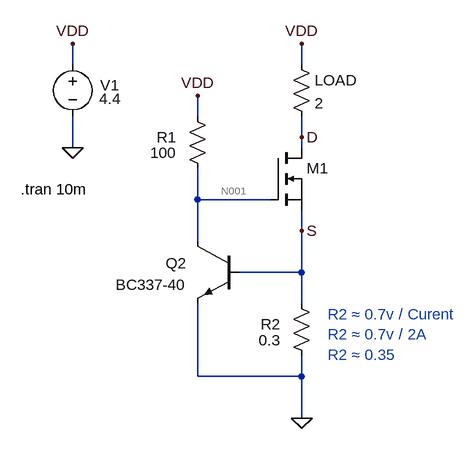
[diagram p0: schematic v1.0.asc]
v1.0.asc, the LTspice schematic file:
Version 4.1
SHEET 1 884 948
WIRE 128 256 128 224
WIRE 480 256 480 224
WIRE 320 336 320 304
WIRE 480 368 480 336
WIRE 128 384 128 336
WIRE 480 384 480 368
WIRE 320 464 320 416
WIRE 432 464 320 464
WIRE 480 512 480 480
WIRE 320 528 320 464
WIRE 480 576 480 512
WIRE 480 576 384 576
WIRE 480 624 480 576
WIRE 320 736 320 624
WIRE 480 736 480 704
WIRE 480 736 320 736
WIRE 480 800 480 736
FLAG 128 384 0
FLAG 480 800 0
FLAG 128 224 VDD
FLAG 480 224 VDD
FLAG 320 304 VDD
FLAG 480 512 S
FLAG 480 368 D
SYMBOL voltage 128 240 R0
WINDOW 0 42 48 Left 2
WINDOW 3 41 69 Left 2
WINDOW 123 0 0 Left 0
WINDOW 39 0 0 Left 0
SYMATTR InstName V1
SYMATTR Value 4.4
SYMBOL res 336 432 R180
WINDOW 0 48 64 Left 2
WINDOW 3 48 40 Left 2
SYMATTR InstName R1
SYMATTR Value 100
SYMBOL npn 384 528 M0
WINDOW 0 81 34 Left 2
WINDOW 3 190 67 Right 2
SYMATTR InstName Q2
SYMATTR Value BC337-40
SYMBOL res 496 720 R180
WINDOW 0 48 64 Left 2
WINDOW 3 48 40 Left 2
SYMATTR InstName R2
SYMATTR Value 0.3
SYMBOL res 464 240 R0
SYMATTR InstName LOAD
SYMATTR Value 2
SYMBOL nmos 432 384 R0
WINDOW 3 56 72 Invisible 2
SYMATTR Value PSMN1R025YLD
SYMATTR InstName M1
TEXT 48 448 Left 2 !.tran 10m
TEXT 520 640 Left 2 ;R2 ≈ 0.7v / Curent\nR2 ≈ 0.7v / 2A\nR2 ≈ 0.35

The netlist it stands for:
* v1.0.asc
V1 VDD 0 4.4
R1 N001 VDD 100
Q2 N001 S 0 0 BC337-40
R2 0 S 0.3
R§LOAD VDD D 2
M1 D N001 S S PSMN1R025YLD
.model NPN NPN
.model PNP PNP
.lib standard.bjt
.model NMOS NMOS
.model PMOS PMOS
.lib standard.mos
.tran 10m
* R2 ≈ 0.7v / Curent
* R2 ≈ 0.7v / 2A
* R2 ≈ 0.35
.backanno
.end

* Results of the author's LTspice run, read from the files saved beside the schematic
* Operating Point, zero values left out:
*   V(d) = 575.9 mV
*   V(n001) = 4.36 V
*   V(s) = 573.6 mV
*   V(vdd) = 4.4 V
*   I(LOAD) = 1.912 A
*   I(R1) = -399.6 µA
*   I(R2) = -1.912 A
*   I(V1) = -1.912 A
*   Ib(Q2) = 934.9 nA
*   Ic(Q2) = 399.6 µA
*   Id(M1) = 1.912 A
*   Ie(Q2) = -400.5 µA
*   Is(M1) = -1.912 A
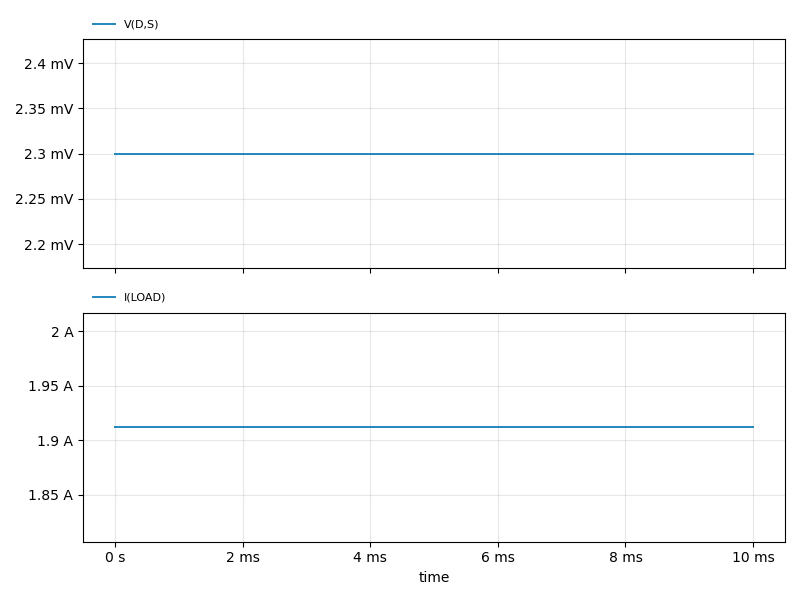
[diagram p1: Transient Analysis of v1.0.asc, plotted from the saved traces]
* Transient Analysis, 1 run:
*   V(D,S): min 2.3 mV, max 2.3 mV, average 2.3 mV, rms 2.3 mV, last 2.3 mV
*   I(LOAD): min 1.912 A, max 1.912 A, average 1.912 A, rms 1.912 A, last 1.912 A